# Altium schematic sheet Z80Console0001.SchDoc
size 381 x 241 mm; SheetNumber: 2; SheetTotal: 3
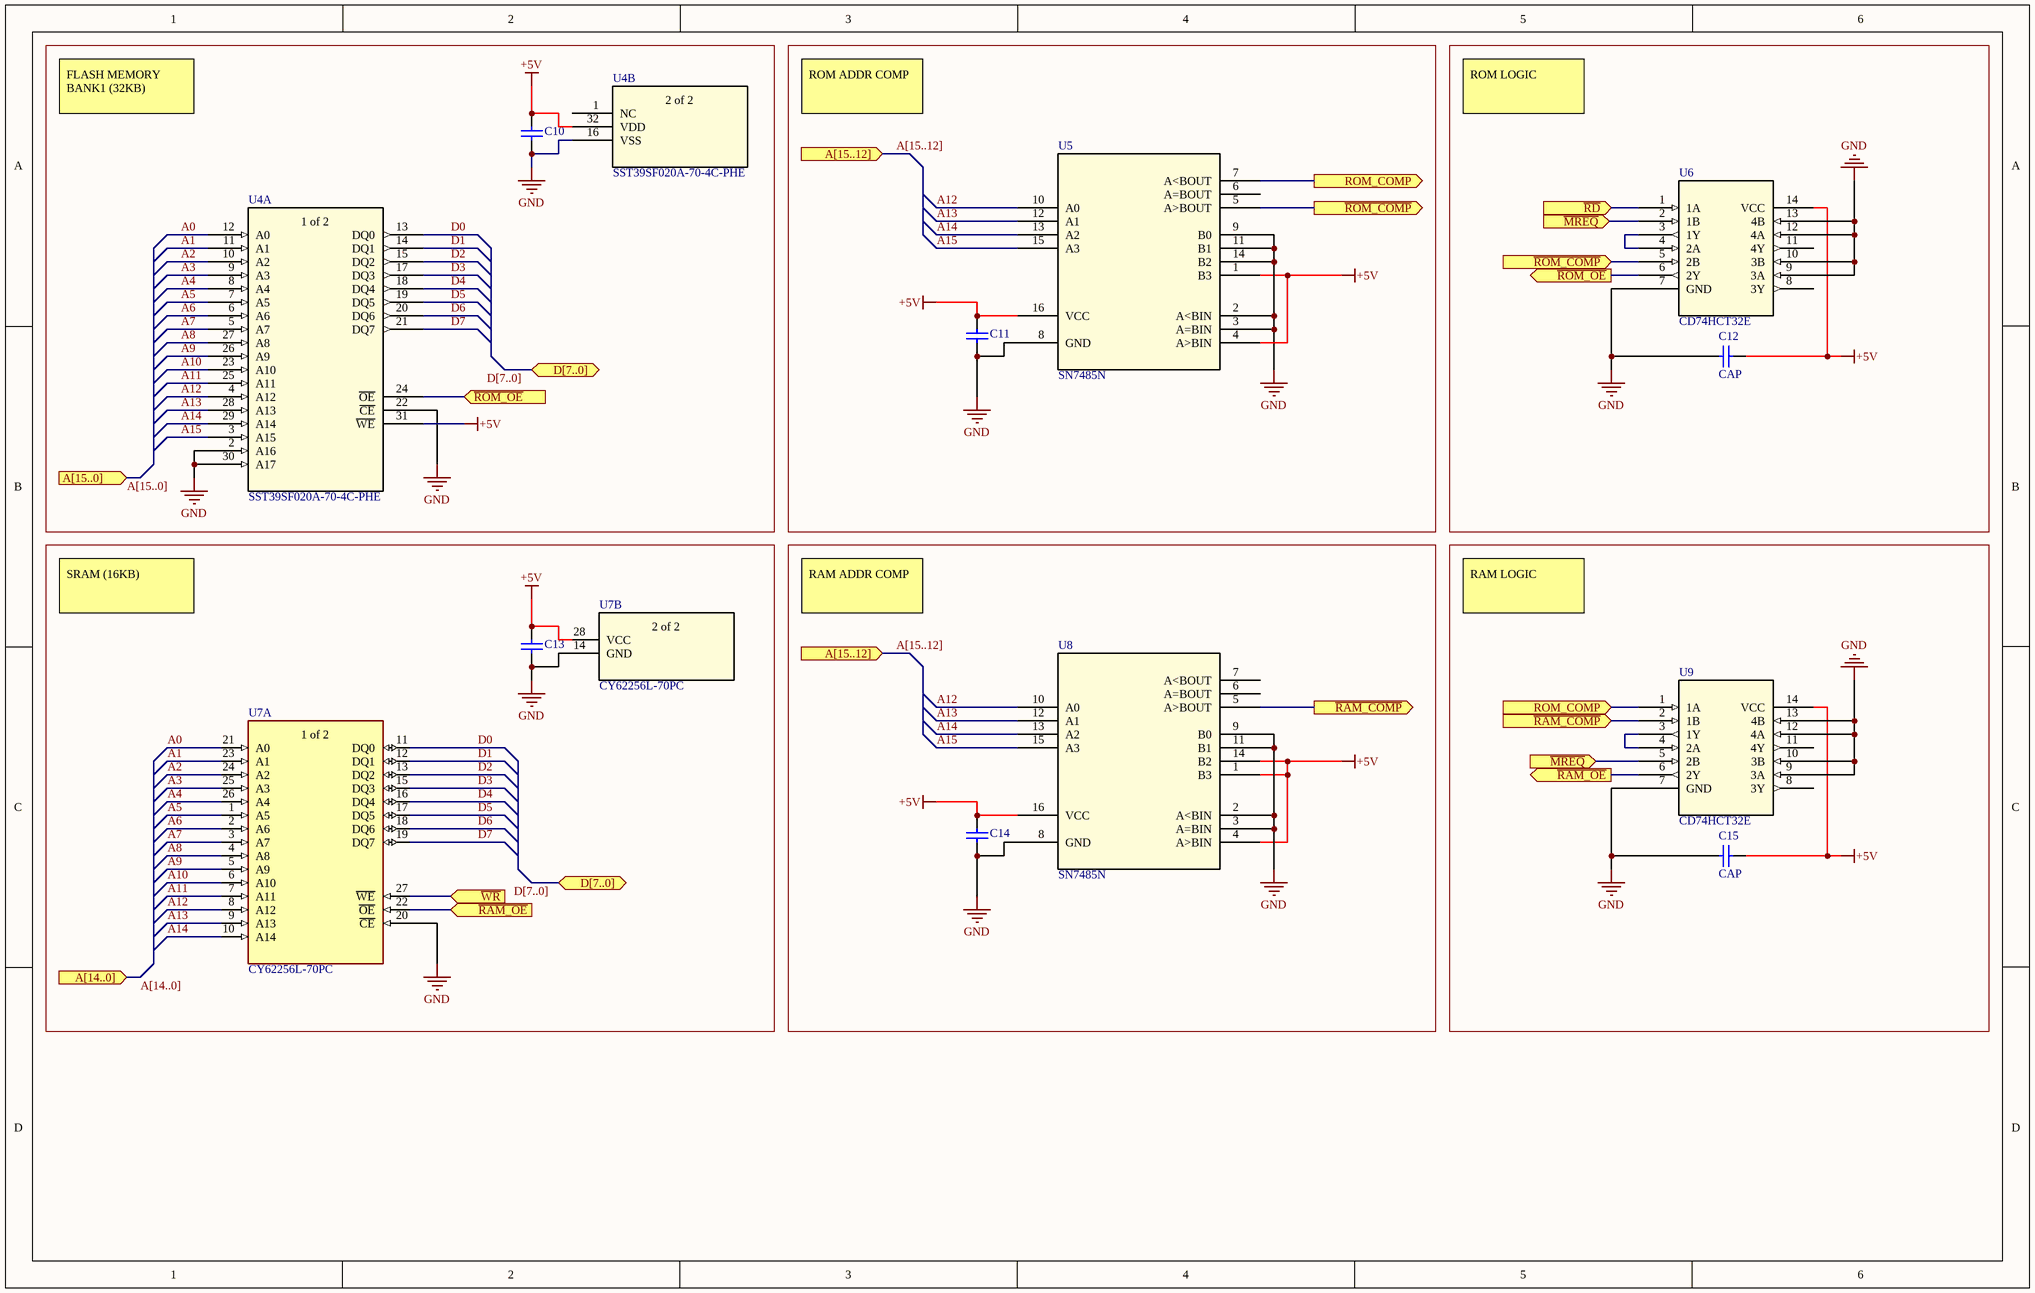
[diagram p0: Z80Console0001.SchDoc]

## Parts
C10  CAP  [CAPC0603(1608)100_N]  (value not drawn)
C11  CAP  [CAPC0603(1608)100_N]  (value not drawn)
C12  CAP  [CAPC0603(1608)100_N]
C13  CAP  [CAPC0603(1608)100_N]  (value not drawn)
C14  CAP  [CAPC0603(1608)100_N]  (value not drawn)
C15  CAP  [CAPC0603(1608)100_N]
U4  SST39SF020A-70-4C-PHE  [PDIP32_PH_SST_MCH]  (parts A,B of 2)
U5  SN7485N  [DIP16_300]
U6  CD74HCT32E  [N14]
U7  CY62256L-70PC  [DIP1587W140P254L3632H381Q28N]  (parts A,B of 2)
U8  SN7485N  [DIP16_300]
U9  CD74HCT32E  [N14]

## Ports
A[14..0] (in, see Z80Console0000[2A], Z80Console0001[1B], Z80Console0001[3A], Z80Console0001[3C], Z80Console0002[1A], Z80Console0002[2C], Z80Console0002[3A], Z80Console0002[5A]), A[15..0] (in, see Z80Console0000[2A], Z80Console0001[1D], Z80Console0001[3A], Z80Console0001[3C], Z80Console0002[1A], Z80Console0002[2C], Z80Console0002[3A], Z80Console0002[5A]), A[15..12] (in, see Z80Console0000[2A], Z80Console0001[1B], Z80Console0001[1D], Z80Console0001[3A], Z80Console0002[1A]), A[15..12] (in, see Z80Console0000[2A], Z80Console0001[1B], Z80Console0001[1D], Z80Console0001[3C], Z80Console0002[1A]), D[7..0] (bidir, see Z80Console0000[2C], Z80Console0001[2B], Z80Console0002[1C]), D[7..0] (bidir, see Z80Console0000[2C], Z80Console0001[2C], Z80Console0002[1C]), ROM_COMP (in, see Z80Console0001[4A]), ROM_COMP (out, see Z80Console0001[5C]), ~{MREQ} (in, see Z80Console0000[1B], Z80Console0001[5A]), ~{MREQ} (in, see Z80Console0000[1B], Z80Console0001[5C]), ~{RAM_COMP} (in, see Z80Console0001[4C]), ~{RAM_COMP} (out, see Z80Console0001[5C]), ~{RAM_OE} (in, see Z80Console0001[5C]), ~{RAM_OE} (out, see Z80Console0001[2C]), ~{RD} (in, see Z80Console0000[1B]), ~{ROM_COMP} (in, see Z80Console0001[4A]), ~{ROM_COMP} (out, see Z80Console0001[5A]), ~{ROM_OE} (in, see Z80Console0001[5A]), ~{ROM_OE} (out, see Z80Console0001[2B]), ~{WR} (in, see Z80Console0000[1B], Z80Console0002[5C])

## Nets
+5V: C10.2 C11.2 C12.2 C13.2 C14.2 C15.2 U4.31(~{WE}) U4.32(VDD) U5.1(B3) U5.4(A>BIN) U5.16(VCC) U6.14(VCC) U7.28(VCC) U8.1(B3) U8.4(A>BIN) U8.14(B2) U8.16(VCC) U9.14(VCC)
GND: C10.1 C11.1 C12.1 C13.1 C14.1 C15.1 U4.2(A16) U4.16(VSS) U4.22(~{CE}) U4.30(A17) U5.2(A<BIN) U5.3(A=BIN) U5.8(GND) U5.9(B0) U5.11(B1) U5.14(B2) U6.7(GND) U6.9(3A) U6.10(3B) U6.12(4A) U6.13(4B) U7.14(GND) U7.20(~{CE}) U8.2(A<BIN) U8.3(A=BIN) U8.8(GND) U8.9(B0) U8.11(B1) U9.7(GND) U9.9(3A) U9.10(3B) U9.12(4A) U9.13(4B)
~{MREQ}: U6.2(1B) U9.5(2B) ; port ~{MREQ}
~{RAM_COMP}: U8.5(A>BOUT) U9.2(1B) ; port ~{RAM_COMP}
~{RAM_OE}: U7.22(~{OE}) U9.6(2Y) ; port ~{RAM_OE}
~{RD}: U6.1(1A) ; port ~{RD}
~{ROM_COMP}: U5.5(A>BOUT) U6.5(2B) ; port ~{ROM_COMP}
~{ROM_OE}: U4.24(~{OE}) U6.6(2Y) ; port ~{ROM_OE}
~{WR}: U7.27(~{WE}) ; port ~{WR}
A0: U4.12(A0) U7.21(A0)
A1: U4.11(A1) U7.23(A1)
A2: U4.10(A2) U7.24(A2)
A3: U4.9(A3) U7.25(A3)
A4: U4.8(A4) U7.26(A4)
A5: U4.7(A5) U7.1(A5)
A6: U4.6(A6) U7.2(A6)
A7: U4.5(A7) U7.3(A7)
A8: U4.27(A8) U7.4(A8)
A9: U4.26(A9) U7.5(A9)
A10: U4.23(A10) U7.6(A10)
A11: U4.25(A11) U7.7(A11)
A12: U4.4(A12) U5.10(A0) U7.8(A12) U8.10(A0)
A13: U4.28(A13) U5.12(A1) U7.9(A13) U8.12(A1)
A14: U4.29(A14) U5.13(A2) U7.10(A14) U8.13(A2)
A15: U4.3(A15) U5.15(A3) U8.15(A3)
D0: U4.13(DQ0) U7.11(DQ0)
D1: U4.14(DQ1) U7.12(DQ1)
D2: U4.15(DQ2) U7.13(DQ2)
D3: U4.17(DQ3) U7.15(DQ3)
D4: U4.18(DQ4) U7.16(DQ4)
D5: U4.19(DQ5) U7.17(DQ5)
D6: U4.20(DQ6) U7.18(DQ6)
D7: U4.21(DQ7) U7.19(DQ7)
ROM_COMP: U5.7(A<BOUT) U9.1(1A) ; port ROM_COMP
NetU6_3: U6.3(1Y) U6.4(2A)
NetU9_3: U9.3(1Y) U9.4(2A)

Not connected (* = marked no-connect by the designer): U4 1(NC); U5 6(A=BOUT); U6 8(3Y) 11(4Y); U8 6(A=BOUT) 7(A<BOUT); U9 8(3Y) 11(4Y)

## Buses and harness runs
bus A[14..0] = port A[14..0]
bus A[15..0] = port A[15..0]
bus A[15..12] = port A[15..12]
bus D[7..0] = port D[7..0]

## Notes on the sheet
- FLASH MEMORY
  BANK1 (32KB)
- ROM ADDR COMP
- ROM LOGIC
- SRAM (16KB)
- RAM ADDR COMP
- RAM LOGIC
- (in symbol CY62256L-70PC, part A) 1 of 2
- (in symbol CY62256L-70PC, part B) 2 of 2
- (in symbol SST39SF020A-70-4C-PHE, part A) 1 of 2
- (in symbol SST39SF020A-70-4C-PHE, part B) 2 of 2

## Library data of the parts
U4 = SST39SF020A-70-4C-PHE: No Description Available; Manufacturer_Name: Microchip; Copyright: Copyright (C) 2025 Ultra Librarian. All rights reserved.; Manufacturer_Part_Number: SST39SF020A-70-4C-PHE; RefDes: RefDes; Type: Type
U5 U8 = SN7485N: No Description Available; Manufacturer_Name: Texas Instruments; Copyright: Copyright (C) 2025 Ultra Librarian. All rights reserved.; Manufacturer_Part_Number: SN7485N; RefDes: RefDes; Type: Type
U6 U9 = CD74HCT32E: 4-ch 2-input 4.5-V to 5.5-V OR gate with TTL-compatible inputs 14-PDIP -55 to 125; Manufacturer_Name: Texas Instruments; Copyright: Copyright (C) 2025 Ultra Librarian. All rights reserved.; Manufacturer_Part_Number: CD74HCT32E; Datasheet: https://www.ti.com/lit/gpn/cd74hct32; RefDes: RefDes; Type: Type
U7 = CY62256L-70PC: 256K (32K x 8) Static RAM